# EAGLE design Stereo_mixer_v1 (EAGLE 9.0.0)
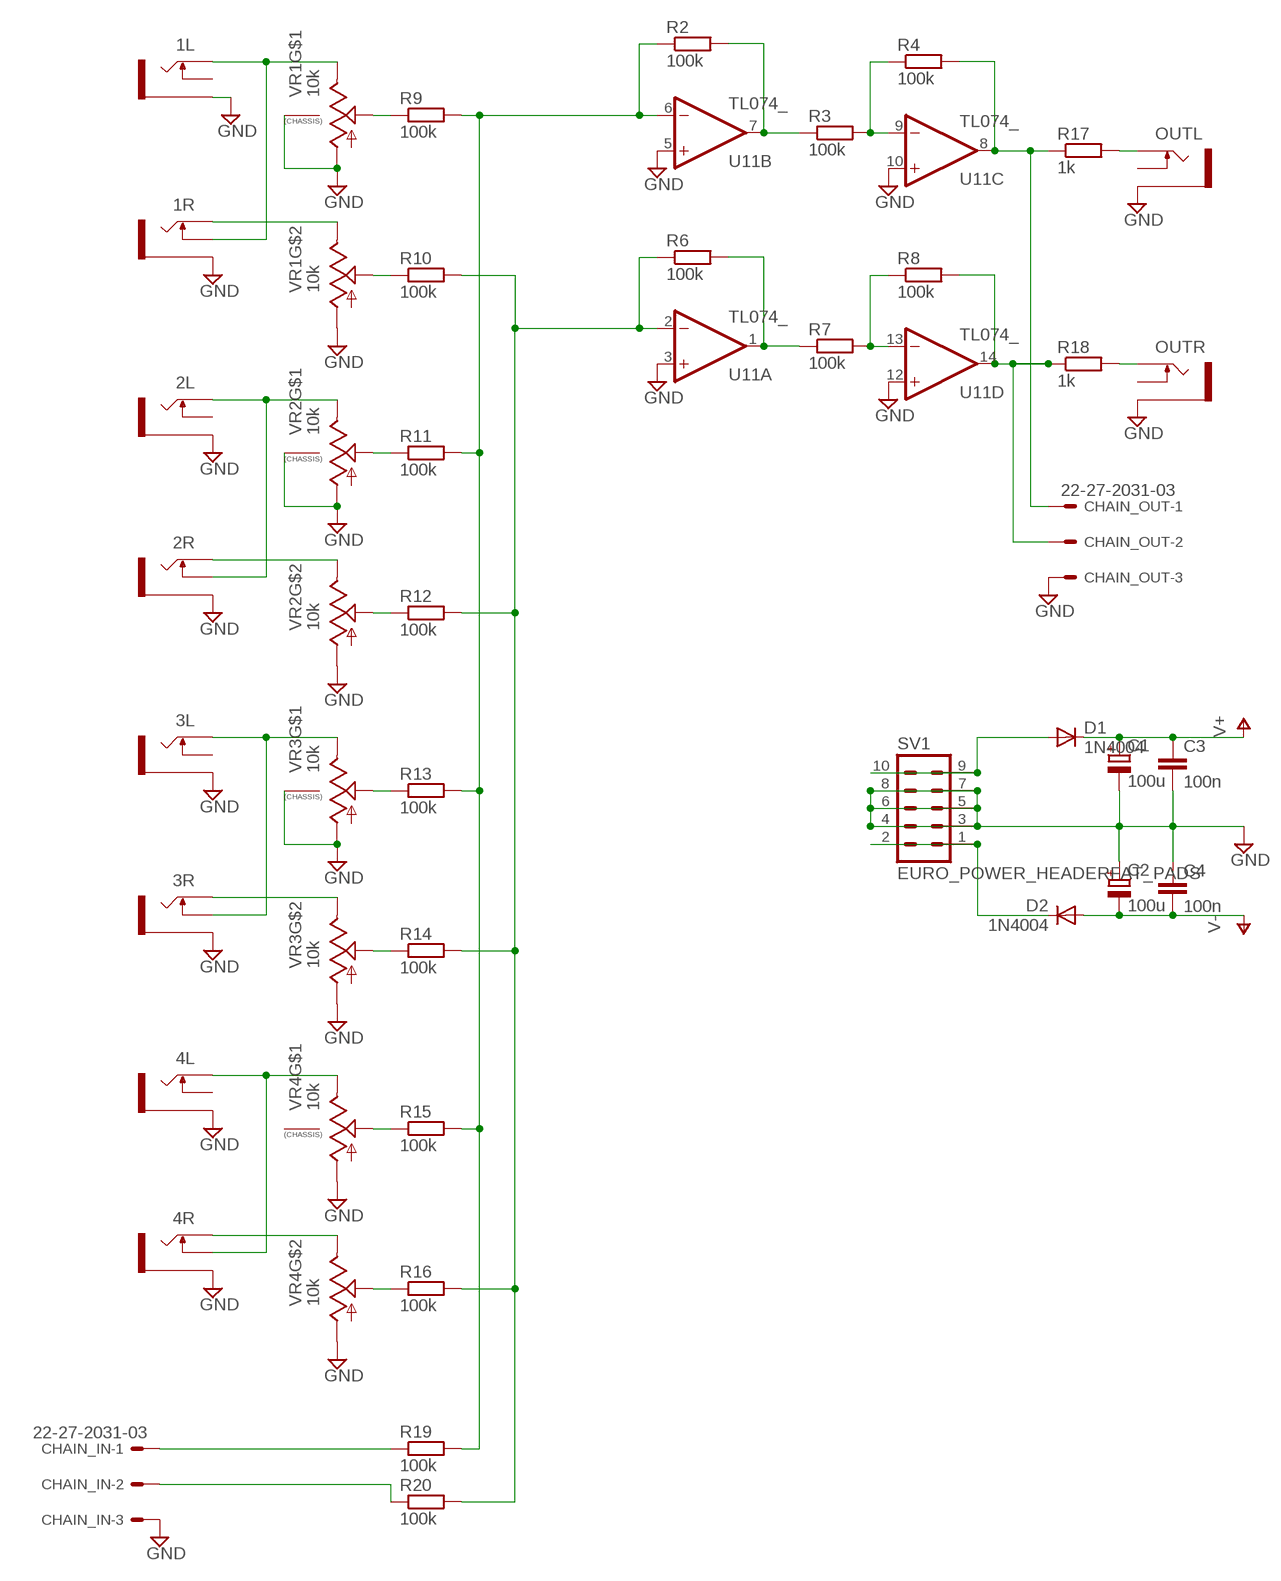
[diagram p0: schematic, sheet 1]

## Parts
1L  THONKICONNNEW  [WQP-PJ301M-12_JACK]
1R  THONKICONNNEW  [WQP-PJ301M-12_JACK]
2L  THONKICONNNEW  [WQP-PJ301M-12_JACK]
2R  THONKICONNNEW  [WQP-PJ301M-12_JACK]
3L  THONKICONNNEW  [WQP-PJ301M-12_JACK]
3R  THONKICONNNEW  [WQP-PJ301M-12_JACK]
4L  THONKICONNNEW  [WQP-PJ301M-12_JACK]
4R  THONKICONNNEW  [WQP-PJ301M-12_JACK]
C1  100u  CPOL-EUE2.5-6  [E2,5-6]
C2  100u  CPOL-EUE2.5-6  [E2,5-6]
C3  100n  C-EU025-024X044  [C025-024X044]
C4  100n  C-EU025-024X044  [C025-024X044]
CHAIN_IN  22-27-2031-03  [6410-03]
CHAIN_OUT  22-27-2031-03  [6410-03]
D1  1N4004  [DO41-10]
D2  1N4004  [DO41-10]
OUTL  THONKICONNNEW  [WQP-PJ301M-12_JACK]
OUTR  THONKICONNNEW  [WQP-PJ301M-12_JACK]
R2  100k  R-EU_0207/7  [0207/7]
R3  100k  R-EU_0207/7  [0207/7]
R4  100k  R-EU_0207/7  [0207/7]
R6  100k  R-EU_0207/7  [0207/7]
R7  100k  R-EU_0207/7  [0207/7]
R8  100k  R-EU_0207/7  [0207/7]
R9  100k  R-EU_0207/7  [0207/7]
R10  100k  R-EU_0207/7  [0207/7]
R11  100k  R-EU_0207/7  [0207/7]
R12  100k  R-EU_0207/7  [0207/7]
R13  100k  R-EU_0207/7  [0207/7]
R14  100k  R-EU_0207/7  [0207/7]
R15  100k  R-EU_0207/7  [0207/7]
R16  100k  R-EU_0207/7  [0207/7]
R17  1k  R-EU_0207/7  [0207/7]
R18  1k  R-EU_0207/7  [0207/7]
R19  100k  R-EU_0207/7  [0207/7]
R20  100k  R-EU_0207/7  [0207/7]
SV1  EURO_POWER_HEADERFAT_PADS  [EURO_PWR_HEADER_FAT]
U11  TL074_  [DIL14]
VR1  10k  ALPHA-9MM-DUALPOT  [DUAL_9MM_SNAP-IN_POT]
VR2  10k  ALPHA-9MM-DUALPOT  [DUAL_9MM_SNAP-IN_POT]
VR3  10k  ALPHA-9MM-DUALPOT  [DUAL_9MM_SNAP-IN_POT]
VR4  10k  ALPHA-9MM-DUALPOT  [DUAL_9MM_SNAP-IN_POT]

## Nets
GND: 1L.P$3_SLEEVE(SLEEVE) 1R.P$3_SLEEVE(SLEEVE) 2L.P$3_SLEEVE(SLEEVE) 2R.P$3_SLEEVE(SLEEVE) 3L.P$3_SLEEVE(SLEEVE) 3R.P$3_SLEEVE(SLEEVE) 4L.P$3_SLEEVE(SLEEVE) 4R.P$3_SLEEVE(SLEEVE) C1.- C2.+ C3.2 C4.1 CHAIN_IN.3 CHAIN_OUT.3 OUTL.P$3_SLEEVE(SLEEVE) OUTR.P$3_SLEEVE(SLEEVE) SV1.3 SV1.4 SV1.5 SV1.6 SV1.7 SV1.8 U11.3(A:+IN) U11.5(B:+IN) U11.10(C:+IN) U11.12(D:+IN) VR1.1(A) VR1.1B(A) VR1.CHASSIS1 VR1.CHASSIS2 VR2.1(A) VR2.1B(A) VR2.CHASSIS1 VR2.CHASSIS2 VR3.1(A) VR3.1B(A) VR3.CHASSIS1 VR3.CHASSIS2 VR4.1(A) VR4.1B(A)
N$1: 1L.P$1_TIP(TIP) 1R.P$2_SWITCH(SWITCH) VR1.3(E)
N$2: R10.1 VR1.2B(S)
N$3: R9.1 VR1.2(S)
N$4: 1R.P$1_TIP(TIP) VR1.3B(E)
N$5: 2L.P$1_TIP(TIP) 2R.P$2_SWITCH(SWITCH) VR2.3(E)
N$6: D1.A SV1.9 SV1.10
N$7: R11.1 VR2.2(S)
N$8: 2R.P$1_TIP(TIP) VR2.3B(E)
N$9: R12.1 VR2.2B(S)
N$10: 3L.P$1_TIP(TIP) 3R.P$2_SWITCH(SWITCH) VR3.3(E)
N$12: R13.1 VR3.2(S)
N$13: R14.1 VR3.2B(S)
N$14: 3R.P$1_TIP(TIP) VR3.3B(E)
N$15: 4L.P$1_TIP(TIP) 4R.P$2_SWITCH(SWITCH) VR4.3(E)
N$16: R15.1 VR4.2(S)
N$17: R16.1 VR4.2B(S)
N$18: 4R.P$1_TIP(TIP) VR4.3B(E)
N$19: CHAIN_IN.1 R19.1
N$20: CHAIN_IN.2 R20.1
N$21: R2.1 R9.2 R11.2 R13.2 R15.2 R19.2 U11.6(B:-IN)
N$22: R6.1 R10.2 R12.2 R14.2 R16.2 R20.2 U11.2(A:-IN)
N$23: R3.2 R4.1 U11.9(C:-IN)
N$24: R7.2 R8.1 U11.13(D:-IN)
N$25: OUTL.P$1_TIP(TIP) R17.2
N$26: OUTR.P$1_TIP(TIP) R18.2
N$27: R6.2 R7.1 U11.1(A:OUT)
N$28: CHAIN_OUT.2 R8.2 R18.1 U11.14(D:OUT)
N$29: CHAIN_OUT.1 R4.2 R17.1 U11.8(C:OUT)
N$30: R2.2 R3.1 U11.7(B:OUT)
N$35: D2.C SV1.1 SV1.2
V+: C1.+ C3.1 D1.C
V-: C2.- C4.2 D2.A
Unconnected: 1L.P$2_SWITCH(SWITCH) 2L.P$2_SWITCH(SWITCH) 3L.P$2_SWITCH(SWITCH) 4L.P$2_SWITCH(SWITCH) OUTL.P$2_SWITCH(SWITCH) OUTR.P$2_SWITCH(SWITCH) VR4.CHASSIS1 VR4.CHASSIS2

## Power pins joined to a net without a drawn wire
V+: U11.4(P:V+)
V-: U11.11(P:V-)

## Library data of the parts
1L 1R 2L 2R 3L 3R 4L 4R OUTL OUTR = MusicThingModular:THONKICONN: 3.5mm socket for Eurorack modular synths
C1 C2 = rcl:CPOL-EU: POLARIZED CAPACITOR, European symbol; SPICEPREFIX: C
C3 C4 = rcl:C-EU: CAPACITOR, European symbol; SPICEPREFIX: C
CHAIN_IN CHAIN_OUT = con-molex:22-?-03: CONNECTOR wire to board 2.54 mm (.1 inch) pitch header; MF: MOLEX; OC_FARNELL: unknown; OC_NEWARK: unknown
D1 D2 = diode:1N4004: DIODE general purpose rectifier, 1 A
R2-R4 R6-R20 = resistor:R-EU_: RESISTOR, European symbol
SV1 = MusicThingModular:EURO_POWER_HEADER: Power Header 10 pin power header for Eurorack Power Supplies Variants with fatter pads for easier soldering, and the LOCK variant which has 5mil offset pins to hold the component in place before soldering
U11 = MusicThingModular:TL074: Generic Quad Op Amp
VR1-VR4 = MusicThingModular:ALPHA-9MM-DUALPOT: 9mm vertical snap-in pot, Alpha / Panasonic style, with a connection to the metal chassis for grounding

## Board
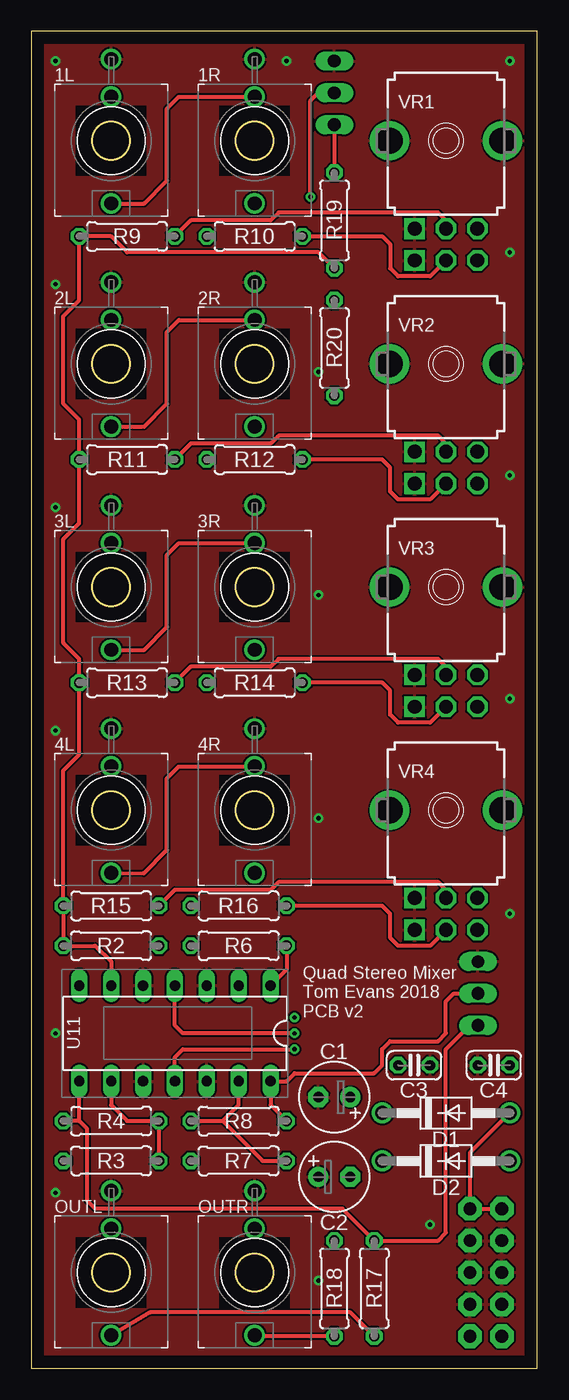
[diagram p1: board, top side]
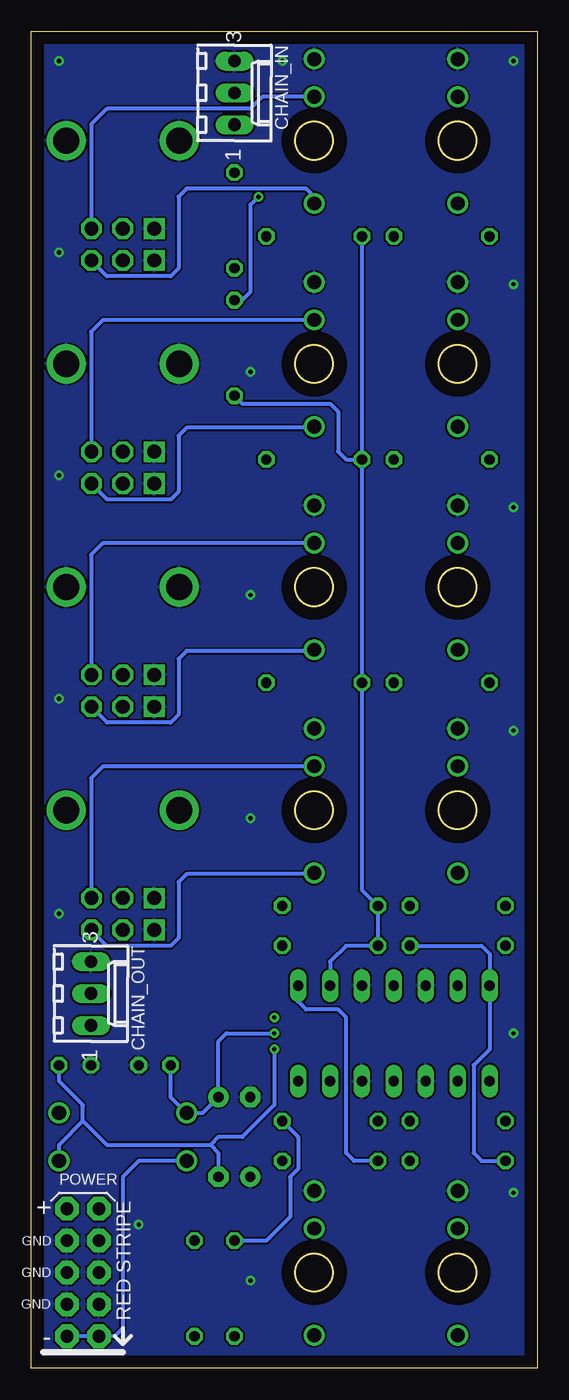
[diagram p2: board, bottom side, seen from below]

Size 40.3 x 106.5 mm. Coordinates in mm from the lower left corner, seen from the top.
Outline: 0,0 40.3,0 40.3,106.5 0,106.5 0,0
Outline: circle at 6.35,97.79 radius 1.5
Outline: circle at 17.78,97.79 radius 1.5
Outline: circle at 6.35,80.01 radius 1.5
Outline: circle at 17.78,80.01 radius 1.5
Outline: circle at 6.35,62.23 radius 1.5
Outline: circle at 17.78,62.23 radius 1.5
Outline: circle at 6.35,44.45 radius 1.5
Outline: circle at 17.78,44.45 radius 1.5
Outline: circle at 6.35,7.62 radius 1.5
Outline: circle at 17.78,7.62 radius 1.5
Copper layers (1*16): Top 0.035mm / dielectric 1.5mm / Bottom 0.035mm
Design rules "default *": minimum track width 12mil, minimum drill 0.35mm, track to track 6mil, track to pad 6mil, pad to pad 6mil, via to via 6mil, smd to smd 6mil, copper to edge 40mil, drill to drill 6mil, minimum pad ring 10mil, minimum via ring 8mil, stop-mask expansion 4mil, vias tented up to drill 0mil, thermal gap 6mil

### Footprints (pad centres in the part's own frame; a part is rotated, then mirrored left to right if it is on the bottom)
WQP-PJ301M-12_JACK = drill 1.1: P$1_TIP 0,5; P$2_SWITCH 0,-3.5; P$3_SLEEVE 0,-6.5
E2,5-6 = drill 0.813 pad 1.6: + -1.27,0 | drill 0.813 pad 1.6 octagon: - 1.27,0
C025-024X044 = drill 0.813 octagon: 1 -1.27,0; 2 1.27,0
6410-03 = drill 1.016 long: 1 2.54,0; 2 0,0; 3 -2.54,0
DO41-10 = drill 1.118: A 5.08,0; C -5.08,0
0207/7 = drill 0.813 octagon: 1 -3.81,0; 2 3.81,0
EURO_PWR_HEADER_FAT = drill 1.016 pad 1.88 octagon: 1 -5.08,-1.27; 2 -5.08,1.27; 3 -2.54,-1.27; 4 -2.54,1.27; 5 0,-1.27; 6 0,1.27; 7 2.54,-1.27; 8 2.54,1.27; 9 5.08,-1.27; 10 5.08,1.27
DIL14 = drill 0.813 long: 1 -7.62,-3.81; 2 -5.08,-3.81; 3 -2.54,-3.81; 4 0,-3.81; 5 2.54,-3.81; 6 5.08,-3.81; 7 7.62,-3.81; 8 7.62,3.81; 9 5.08,3.81; 10 2.54,3.81; 11 0,3.81; 12 -2.54,3.81; 13 -5.08,3.81; 14 -7.62,3.81
DUAL_9MM_SNAP-IN_POT = drill 1.1 square: 1 -2.5,-7; 1B -2.5,-9.54 | drill 1.1 octagon: 2 0,-7; 2B 0,-9.54; 3 2.5,-7; 3B 2.5,-9.54 | drill 2.1 pad 2.54: CHASSIS1 -4.5,0; CHASSIS2 4.5,0

### Placement (x,y rotation side)
1L  6.35,97.79 180 top
1R  17.78,97.79 180 top
2L  6.35,80.01 180 top
2R  17.78,80.01 180 top
3L  6.35,62.23 180 top
3R  17.78,62.23 180 top
4L  6.35,44.45 180 top
4R  17.78,44.45 180 top
C1  24.13,21.59 180 top
C2  24.13,15.24 0 top
C3  30.48,24.13 0 top
C4  36.83,24.13 0 top
CHAIN_IN  24.13,101.6 270 bottom
CHAIN_OUT  35.56,29.84 270 bottom
D1  33.02,20.32 0 top
D2  33.02,16.51 0 top
OUTL  6.35,7.62 180 top
OUTR  17.78,7.62 180 top
R2  6.35,33.66 0 top
R3  6.35,16.51 0 top
R4  6.35,19.68 180 top
R6  16.51,33.66 0 top
R7  16.51,16.51 0 top
R8  16.51,19.68 0 top
R9  7.62,90.17 180 top
R10  17.78,90.17 180 top
R11  7.62,72.39 180 top
R12  17.78,72.39 180 top
R13  7.62,54.61 180 top
R14  17.78,54.61 180 top
R15  6.35,36.83 180 top
R16  16.51,36.83 180 top
R17  27.3,6.35 270 top
R18  24.13,6.35 270 top
R19  24.13,91.44 270 top
R20  24.13,81.28 270 top
SV1  36.2,7.62 90 bottom
U11  11.43,26.67 180 top
VR1  33.02,97.79 0 top
VR2  33.02,80.01 0 top
VR3  33.02,62.23 0 top
VR4  33.02,44.45 0 top

### Tracks (layer width: path | path; a pad name or v marks a point on that pad's centre or on a via)
GND  (via drill 0.35)
  other vias: 1.91,104.14 20.32,104.14 1.91,86.36 1.91,68.58 1.91,50.8 1.91,26.67 1.91,13.97 22.86,6.99 31.75,11.43 38.1,36.2 22.86,43.81 38.1,53.34 22.86,61.59 38.1,71.12 22.86,79.38 38.1,88.9 38.1,104.14
  pour Top: 0,106.5 0,0 40.3,0 40.3,106.5
  pour Bottom: 0,106.5 0,0 40.3,0 40.3,106.5
N$1
  Top 0.305: 1L.P$1_TIP 8.97,92.79 10.79,94.61 10.79,100.33 11.76,101.29 1R.P$2_SWITCH
  Bottom 0.305: 1R.P$2_SWITCH 21.9,101.29 22.86,100.33 34.29,100.33 35.52,99.1 VR1.3
N$2
  Top 0.305: VR1.2B 31.77,87 29.21,87 28.57,87.63 28.57,89.53 27.94,90.17 R10.1
N$3
  Top 0.305: VR1.2 33.02,91.44 32.38,92.08 19.68,92.08 19.05,91.44 12.7,91.44 R9.1
N$4
  Bottom 0.305: 1R.P$1_TIP 17.78,93.34 18.41,93.98 27.94,93.98 28.57,93.34 28.57,87.63 29.21,87 34.29,87 35.52,88.22 VR1.3B
N$5
  Top 0.305: 2L.P$1_TIP 8.97,75.01 10.79,76.83 10.79,82.55 11.76,83.51 2R.P$2_SWITCH
  Bottom 0.305: 2R.P$2_SWITCH 34.6,83.51 35.56,82.55 35.52,82.51 VR2.3
N$6
  Top 0.305: D1.A 34.92,17.14 SV1.9 SV1.10
N$7
  Top 0.305: VR2.2 33.02,73.66 32.38,74.3 19.68,74.3 19.05,73.66 12.7,73.66 R11.1
N$8
  Bottom 0.305: 2R.P$1_TIP 17.86,74.93 27.94,74.93 28.57,74.3 28.57,69.85 29.21,69.22 34.29,69.22 34.29,69.24 VR2.3B
N$9
  Top 0.305: VR2.2B 31.77,69.22 29.21,69.22 28.57,69.85 28.57,71.75 27.94,72.39 R12.1
N$10
  Top 0.305: 3L.P$1_TIP 8.97,57.23 10.79,59.05 10.79,64.77 11.76,65.73 3R.P$2_SWITCH
  Bottom 0.305: 3R.P$2_SWITCH 34.6,65.73 35.56,64.77 35.52,64.73 VR3.3
N$11  (via drill 0.35)
  other vias: 20.95,27.94
N$12
  Top 0.305: VR3.2 33.02,55.88 32.38,56.52 19.68,56.52 19.05,55.88 12.7,55.88 R13.1
N$13
  Top 0.305: VR3.2B 31.77,51.44 29.21,51.44 28.57,52.07 28.57,53.98 27.94,54.61 R14.1
N$14
  Bottom 0.305: 3R.P$1_TIP 17.86,57.15 27.94,57.15 28.57,56.52 28.57,52.07 29.21,51.44 34.29,51.44 34.29,51.46 VR3.3B
N$15
  Top 0.305: 4L.P$1_TIP 8.95,39.42 10.79,41.27 10.79,46.99 11.73,47.92 4R.P$2_SWITCH
  Bottom 0.305: 4R.P$2_SWITCH 34.62,47.92 35.56,46.99 35.52,46.95 VR4.3
N$16
  Top 0.305: VR4.2 33.02,38.1 32.38,38.73 19.68,38.73 19.05,38.1 11.43,38.1 R15.1
N$17
  Top 0.305: VR4.2B 31.77,33.66 29.21,33.66 28.57,34.29 28.57,36.2 27.94,36.83 R16.1
N$18
  Bottom 0.305: 4R.P$1_TIP 17.81,39.37 27.94,39.37 28.57,38.73 28.57,34.29 29.21,33.66 34.29,33.66 35.52,34.88 VR4.3B
N$19
  Top 0.305: CHAIN_IN.1 R19.1
N$20  (via drill 0.35)
  Top 0.305: v22.23,93.3 22.23,100.97 22.86,101.6 CHAIN_IN.2
  Bottom 0.305: v22.23,93.3 22.81,92.71 22.86,92.71 22.86,85.72 23.5,85.09 R20.1
N$21
  Top 0.305: R19.2 22.86,88.9 7.62,88.9 6.35,90.17 R9.2 3.81,85.09 2.54,83.82 2.54,76.83 3.81,75.56 R11.2 3.81,67.31 2.54,66.04 2.54,57.78 3.81,56.52 R13.2 3.81,48.9 2.54,47.62 R15.2 R2.1 5.08,33.66 6.35,32.38 U11.6
N$22
  Bottom 0.305: R10.2 R12.2 | R12.2 R14.2 13.97,38.1 R16.2 R6.1 15.24,33.66 16.51,32.38 U11.2 | R20.2 23.5,76.83 16.51,76.83 15.88,76.2 15.88,73.03 15.24,72.39 R12.2
N$23
  Top 0.305: U11.9 6.35,20.95 7.62,19.68 R4.1 R3.2
N$24
  Top 0.305: R8.1 15.24,19.68 | 15.24,19.68 16.51,20.95 U11.13 | 15.24,19.68 18.41,16.51 R7.2
N$25
  Top 0.305: OUTL.P$1_TIP 9.45,4.45 25.4,4.45 R17.2
N$26
  Top 0.305: R18.2 17.86,2.54 OUTR.P$1_TIP
N$27
  Top 0.305: R6.2 20.32,31.75 U11.1
  Bottom 0.305: U11.1 19.05,29.21 18.41,28.57 15.88,28.57 15.24,27.94 15.24,17.14 14.61,16.51 R7.1
N$28
  Top 0.305: R8.2 19.05,20.95 U11.14 20.32,22.86 20.95,23.5 27.3,23.5 27.94,24.13 27.94,25.4 28.57,26.04 32.38,26.04 33.02,26.67 33.02,29.21 33.66,29.84 CHAIN_OUT.2
  Bottom 0.305: R8.2 19.05,18.41 19.05,15.88 19.68,15.24 19.68,12.06 21.59,10.16 R18.1
N$29
  Top 0.305: 3.81,19.68 4.45,19.05 4.45,13.34 5.08,12.7 24.77,12.7 R17.1 32.38,10.16 33.02,10.79 33.02,25.4 34.29,26.67 34.92,27.3 CHAIN_OUT.1 | 3.81,19.68 R4.2 | 3.81,19.68 U11.8
N$30
  Bottom 0.305: R2.2 4.45,33.66 3.81,33.02 U11.7 3.81,25.4 5.08,24.13 5.08,17.14 4.45,16.51 R3.1
N$35
  Bottom 0.305: D2.C 31.75,16.51 33.02,15.24 33.02,3.17 33.66,2.54 SV1.1 SV1.2
V+  (via drill 0.35)
  Top 0.305: v20.95,26.67 12.06,26.67 11.43,27.3 U11.4
  Bottom 0.305: C3.1 29.21,21.59 D1.C 26.67,20.32 C1.+ 25.4,26.04 24.77,26.67 v20.95,26.67
V-  (via drill 0.35)
  Top 0.305: U11.11 11.43,24.77 12.06,25.4 v20.95,25.4
  Bottom 0.305: D2.A 38.1,17.78 36.2,19.68 | 36.2,19.68 34.29,17.78 26.04,17.78 | 26.04,17.78 25.4,17.14 C2.- | 36.2,19.68 36.2,20.95 38.1,22.86 C4.2 | v20.95,25.4 20.95,20.95 23.5,18.41 25.4,18.41 26.04,17.78

### Text on the board
tNames: Quad Stereo Mixer / Tom Evans 2018 / PCB v2